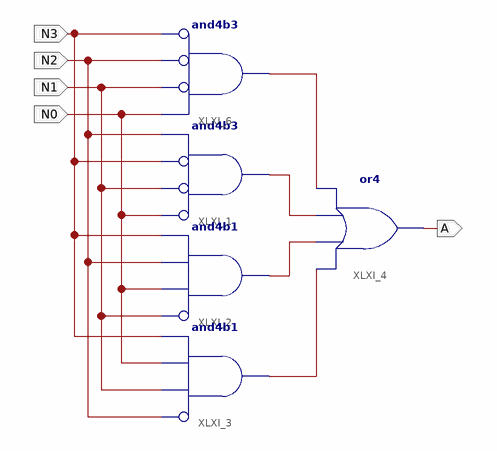
[diagram p0: schematic sheet 1]
// Xilinx ISE schematic comb_a1.sch (spartan3e) as structural Verilog: 5 symbols, 5 ports
module comb_a1 (
  input  N2,
  input  N1,
  input  N3,
  input  N0,
  output A
);

  wire XLXN_1, XLXN_2, XLXN_3, XLXN_4;

  and XLXI_1 (XLXN_2, ~N0, ~N1, ~N3, N2);  // and4b3
  and XLXI_2 (XLXN_3, ~N1, N0, N2, N3);  // and4b1
  and XLXI_3 (XLXN_4, ~N2, N1, N0, N3);  // and4b1
  or XLXI_4 (A, XLXN_4, XLXN_3, XLXN_2, XLXN_1);
  and XLXI_6 (XLXN_1, ~N3, ~N2, ~N1, N0);  // and4b3
endmodule
